# Altium schematic sheet PCB.SchDoc
size A4; PageSetup: Record=PageOptions|CenterHorizontal=True|CenterVertical=True|PrintScale=1.00|XCorrection=1.00|YCorrection=1.00|PrintKind=0|BorderSize=5000000|LeftOffset=0|BottomOffset=0|Orientation=2|PaperLength=1000|PaperWidth=1000|Scale=100|PaperSource=7|PrintQuality=-3|MediaType=1|DitherType=10|PrintScaleMode=1|PaperKind=A4|PaperIndex=9
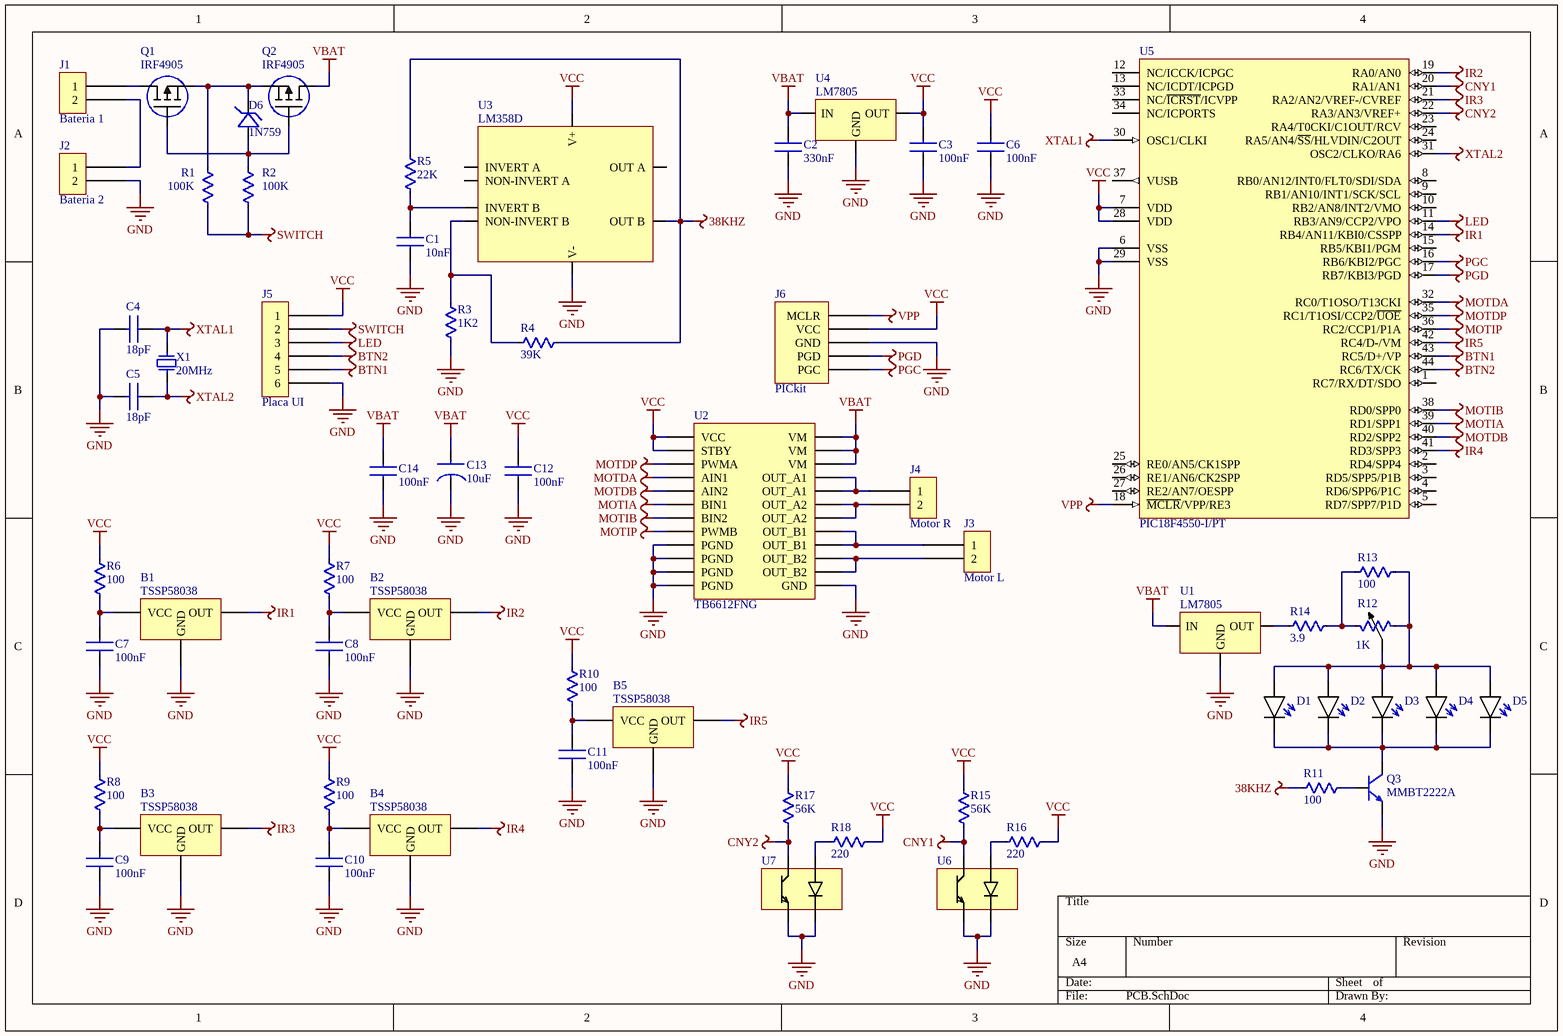
[diagram p0: PCB.SchDoc]

## Parts
B1  TSSP58038  [TSSP58038]
B2  TSSP58038  [TSSP58038]
B3  TSSP58038  [TSSP58038]
B4  TSSP58038  [TSSP58038]
B5  TSSP58038  [TSSP58038]
C1  value 10nF  [C1206]  (hidden comment: CAP-CER)
C2  value 330nF  [C1206]  (hidden comment: CAP-CER)
C3  value 100nF  [C1206]  (hidden comment: CAP-CER)
C4  value 18pF  [C1206]  (hidden comment: CAP-CER)
C5  value 18pF  [C1206]  (hidden comment: CAP-CER)
C6  value 100nF  [C1206]  (hidden comment: CAP-CER)
C7  value 100nF  [C1206]  (hidden comment: CAP-CER)
C8  value 100nF  [C1206]  (hidden comment: CAP-CER)
C9  value 100nF  [C1206]  (hidden comment: CAP-CER)
C10  value 100nF  [C1206]  (hidden comment: CAP-CER)
C11  value 100nF  [C1206]  (hidden comment: CAP-CER)
C12  value 100nF  [C1206]  (hidden comment: CAP-CER)
C13  value 10uF  [CAP-ELEC-5x11x2mm]  (hidden comment: CAP-ELEC)
C14  value 100nF  [C1206]  (hidden comment: CAP-CER)
D1  LED  [LED-5MM-CLEAR]  (value not drawn)
D2  LED  [LED-5MM-CLEAR]  (value not drawn)
D3  LED  [LED-5MM-CLEAR]  (value not drawn)
D4  LED  [LED-5MM-CLEAR]  (value not drawn)
D5  LED  [LED-5MM-CLEAR]  (value not drawn)
D6  1N759  [SOD-80]
J1  Bateria 1  [HEADER 1x2]
J2  Bateria 2  [HEADER 1x2]
J3  Motor L  [HEADER 1x2]
J4  Motor R  [HEADER 1x2]
J5  Placa UI  [Header 1x6]
J6  PICkit  [Header 1x5]
Q1  IRF4905  [TO-220]
Q2  IRF4905  [TO-220]
Q3  MMBT2222A  [SOT-23]
R1  value 100K  [R1206]  (hidden comment: RES)
R2  value 100K  [R1206]  (hidden comment: RES)
R3  value 1K2  [R1206]  (hidden comment: RES)
R4  value 39K  [R1206]  (hidden comment: RES)
R5  value 22K  [R1206]  (hidden comment: RES)
R6  value 100  [R1206]  (hidden comment: RES)
R7  value 100  [R1206]  (hidden comment: RES)
R8  value 100  [R1206]  (hidden comment: RES)
R9  value 100  [R1206]  (hidden comment: RES)
R10  value 100  [R1206]  (hidden comment: RES)
R11  value 100  [R1206]  (hidden comment: RES)
R12  value 1K  [TRIMPOT]  (hidden comment: POT)
R13  value 100  [R1206]  (hidden comment: RES)
R14  value 3.9  [R1206]  (hidden comment: RES)
R15  value 56K  [R1206]  (hidden comment: RES)
R16  value 220  [R1206]  (hidden comment: RES)
R17  value 56K  [R1206]  (hidden comment: RES)
R18  value 220  [R1206]  (hidden comment: RES)
U1  LM7805  [TO-252]
U2  TB6612FNG  [SSOP24]
U3  LM358D  [SOIC-8]
U4  LM7805  [TO-252]
U5  PIC18F4550-I/PT  [TQFP-PT44_N]
U6  QRE1113GR  [QRE1113GR]  (value not drawn)
U7  QRE1113GR  [QRE1113GR]  (value not drawn)
X1  FREQUENCY: 20MHz  [HC-49/S]  (hidden comment: XTAL)

## Nets
38KHZ: R4.2 R5.2 R11.1 U3.7(OUT_B)
BTN1: J5.5 U5.43(RC5/D+/VP)
BTN2: J5.4 U5.44(RC6/TX/CK)
CNY1: R15.1 U5.20(RA1/AN1) U6.C
CNY2: R17.1 U5.22(RA3/AN3/VREF+) U7.C
GND: B1.2(GND) B2.2(GND) B3.2(GND) B4.2(GND) B5.2(GND) C1.2 C2.1 C3.1 C4.1 C5.1 C6.1 C7.1 C8.1 C9.1 C10.1 C11.1 C12.1 C13.2 C14.1 J2.2 J5.6 J6.3(GND) Q3.E R3.1 U1.2(GND) U2.3(PGND) U2.4(PGND) U2.9(PGND) U2.10(PGND) U2.18(GND) U3.4(V-) U4.2(GND) U5.6(VSS) U5.29(VSS) U6.E U6.K U7.E U7.K
IR1: B1.1(OUT) U5.14(RB4/AN11/KBI0/CSSPP)
IR2: B2.1(OUT) U5.19(RA0/AN0)
IR3: B3.1(OUT) U5.21(RA2/AN2/VREF-/CVREF)
IR4: B4.1(OUT) U5.41(RD3/SPP3)
IR5: B5.1(OUT) U5.42(RC4/D-/VM)
LED: J5.3 U5.11(RB3/AN9/CCP2/VPO)
MOTDA: U2.21(AIN1) U5.32(RC0/T1OSO/T13CKI)
MOTDB: U2.22(AIN2) U5.40(RD2/SPP2)
MOTDP: U2.23(PWMA) U5.35(RC1/T1OSI/CCP2/~{UOE})
MOTIA: U2.17(BIN1) U5.39(RD1/SPP1)
MOTIB: U2.16(BIN2) U5.38(RD0/SPP0)
MOTIP: U2.15(PWMB) U5.36(RC2/CCP1/P1A)
PGC: J6.5(PGC) U5.16(RB6/KBI2/PGC)
PGD: J6.4(PGD) U5.17(RB7/KBI3/PGD)
SWITCH: J5.2 R1.2 R2.1
VBAT: C2.2 C13.1 C14.2 Q2.D U1.1(IN) U2.13(VM) U2.14(VM) U2.24(VM) U4.1(IN)
VCC: C3.2 C6.2 C12.2 J5.1 J6.2(VCC) R6.2 R7.2 R8.2 R9.2 R10.2 R15.2 R16.2 R17.2 R18.2 U2.19(STBY) U2.20(VCC) U3.8(V+) U4.3(OUT) U5.7(VDD) U5.28(VDD)
VPP: J6.1(MCLR) U5.18(~{MCLR}/VPP/RE3)
XTAL1: C4.2 U5.30(OSC1/CLKI) X1.2
XTAL2: C5.2 U5.31(OSC2/CLKO/RA6) X1.1
NetB1_3: B1.3(VCC) C7.2 R6.1
NetB2_3: B2.3(VCC) C8.2 R7.1
NetB3_3: B3.3(VCC) C9.2 R8.1
NetB4_3: B4.3(VCC) C10.2 R9.1
NetB5_3: B5.3(VCC) C11.2 R10.1
NetC1_1: C1.1 R5.1 U3.6(INVERT_B)
NetD1_A: D1.A D2.A D3.A D4.A D5.A R12.2 R12.3 R13.2
NetD1_K: D1.K D2.K D3.K D4.K D5.K Q3.C
NetD6_A: D6.A Q1.G Q2.G R2.2
NetD6_K: D6.K Q1.S Q2.S R1.1
NetJ1_1: J1.1 Q1.D
NetJ1_2: J1.2 J2.1
NetJ3_1: J3.1 U2.11(OUT_B1) U2.12(OUT_B1)
NetJ3_2: J3.2 U2.7(OUT_B2) U2.8(OUT_B2)
NetJ4_1: J4.1 U2.1(OUT_A1) U2.2(OUT_A1)
NetJ4_2: J4.2 U2.5(OUT_A2) U2.6(OUT_A2)
NetQ3_B: Q3.B R11.2
NetR3_2: R3.2 R4.1 U3.5(NON-INVERT_B)
NetR12_1: R12.1 R13.1 R14.2
NetR14_1: R14.1 U1.3(OUT)
NetR16_1: R16.1 U6.A
NetR18_1: R18.1 U7.A

Not connected (* = marked no-connect by the designer): U3 1(OUT_A) 2(INVERT_A) 3(NON-INVERT_A); U5 1(RC7/RX/DT/SDO) 2(RD4/SPP4) 3(RD5/SPP5/P1B) 4(RD6/SPP6/P1C) 5(RD7/SPP7/P1D) 8(RB0/AN12/INT0/FLT0/SDI/SDA) 9(RB1/AN10/INT1/SCK/SCL) 10(RB2/AN8/INT2/VMO) 12(NC/ICCK/ICPGC) 13(NC/ICDT/ICPGD) 15(RB5/KBI1/PGM) 23(RA4/T0CKI/C1OUT/RCV) 24(RA5/AN4/~{SS}/HLVDIN/C2OUT) 25(RE0/AN5/CK1SPP) 26(RE1/AN6/CK2SPP) 27(RE2/AN7/OESPP) 33(NC/~{ICRST}/ICVPP) 34(NC/ICPORTS) 37(VUSB)

## Library data of the parts
D6 = ZENER
J1-J4 = Header 1x2
J5 = Header 1x6
Q1 Q2 = P-MOSFET: pin to pad: D>2 G>1 S>3
Q3 = NPN
U1 U4 = LM78XX
U2 = TB6612FNG: otor / Motion / Ignition Controllers & Drivers Brush Motor Driver IC; Manufacturer_Name: Toshiba; Manufacturer_Part_Number: TB6612FNG,C,8,EL; Geometry.Height: 1.6mm; RS Part Number: *; RS Price/Stock: *; Arrow Part Number: TB6612FNG,C,8,EL; Arrow Price/Stock: https://www.arrow.com/en/products/tb6612fngc8el/toshiba; Datasheet Link: http://toshiba.semicon-storage.com/info/docget.jsp?did=10660&prodName=TB6612FNG
U3 = LM358
U5 = PIC18F4550-I/PT: High Performance, Enhanced Flash, USB Microcontroller with nanoWatt Technology, 32K Flash, 44-Pin TQFP, Industrial Temperature Range; Published: 29-Jan-2009; LatestRevisionDate: 02-Dec-2009; LatestRevisionNote: Updated to datasheet revision E, Aug-2008; DatasheetVersion: revE, Aug-2008; PackageVersion: revBB, Aug-2009; PackageReference: TQFP-PT44; Publisher: Altium Limited; PackageDescription: 44-Lead Plastic Thin Quad Flatpack (PT) - 10x10x1mm Body, 2.00mm [TQFP]; Supplier 1: Digi-Key; Supplier Part Number 1: PIC18F4550-I/PT-ND; Supplier 2: Farnell; Supplier Part Number 2: 9321365; Supplier 3: Farnell; Supplier Part Number 3: 1528447; Code_JEDEC: MS-026; ComponentLink1Description: Datasheet; ComponentLink1URL: http://ww1.microchip.com/downloads/en/DeviceDoc/39632e.pdf; ComponentLink2Description: Packaging Specification; ComponentLink2URL: http://www.microchip.com/stellent/groups/techpub_sg/documents/packagingspec/en012702.pdf; ComponentLink3Description: Microchip.com Home; ComponentLink3URL: http://www.microchip.com/
U6 U7 = QRE1113GR: MF: ON Semiconductor; Price: 0.46 USD; MP: QRE1113GR; Package: SMD-4 ON Semiconductor; Availability: Good; Value: *